# Altium schematic sheet ExpandBoard-103-003.SchDoc
size A4
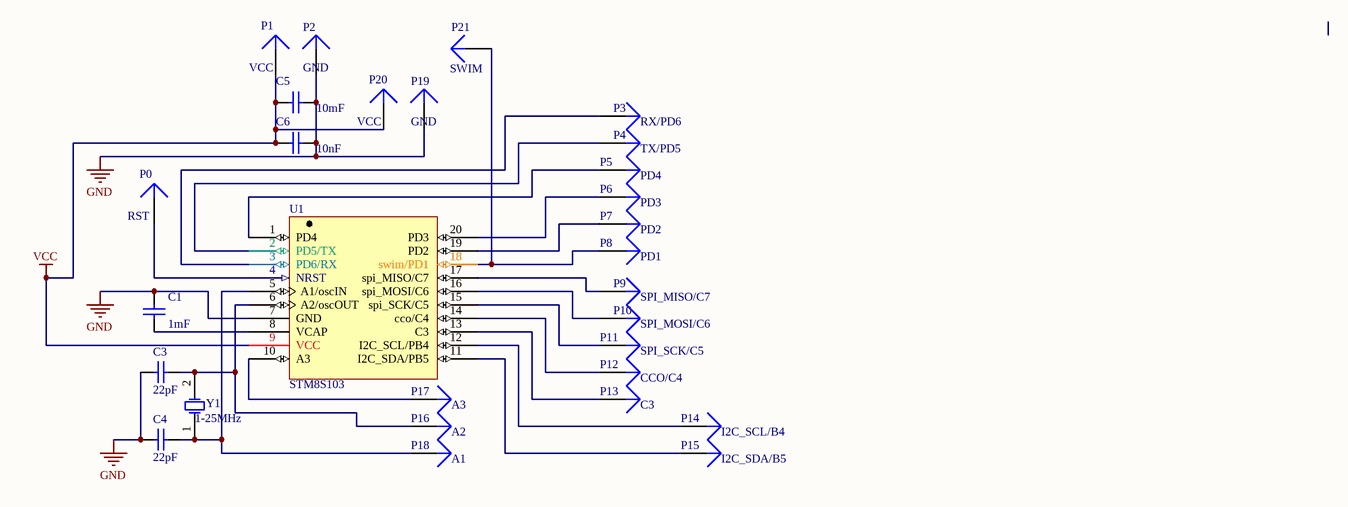
[diagram p0: ExpandBoard-103-003.SchDoc]

## Parts
C1  1mF  [CAPC0805(2012)75_L]
C3  22pF  [CAPC0805(2012)75_N]
C4  22pF  [CAPC0805(2012)75_N]
C5  10mF  [CAPC0805(2012)75_L]
C6  10nF  [CAPC0805(2012)75_L]
P0  RST  [PIN1]
P1  VCC  [PIN1]
P2  GND  [PIN1]
P3  RX/PD6  [PIN1]
P4  TX/PD5  [PIN1]
P5  PD4  [PIN1]
P6  PD3  [PIN1]
P7  PD2  [PIN1]
P8  PD1  [PIN1]
P9  SPI_MISO/C7  [PIN1]
P10  SPI_MOSI/C6  [PIN1]
P11  SPI_SCK/C5  [PIN1]
P12  CCO/C4  [PIN1]
P13  C3  [PIN1]
P14  I2C_SCL/B4  [PIN1]
P15  I2C_SDA/B5  [PIN1]
P16  A2  [PIN1]
P17  A3  [PIN1]
P18  A1  [PIN1]
P19  GND  [PIN1]
P20  VCC  [PIN1]
P21  SWIM  [PIN1]
U1  STM8S103  [TSSOP20]
Y1  1-25MHz  [3.2X1.6X1.1]

## Nets
GND: C1.2 C3.2 C4.2 C5.1 C6.1 P2.1 P19.1 U1.7(GND)
VCC: C5.2 C6.2 P1.1 P20.1 U1.9(VCC)
NetC1_1: C1.1 U1.8(VCAP)
NetC3_1: C3.1 P16.1 U1.6(A2/oscOUT) Y1.2(OSC2)
NetC4_1: C4.1 P18.1 U1.5(A1/oscIN) Y1.1(OSC1)
NetP0_1: P0.1 U1.4(NRST)
NetP3_1: P3.1 U1.3(PD6/RX)
NetP4_1: P4.1 U1.2(PD5/TX)
NetP5_1: P5.1 U1.1(PD4)
NetP6_1: P6.1 U1.20(PD3)
NetP7_1: P7.1 U1.19(PD2)
NetP8_1: P8.1 P21.1 U1.18(swim/PD1)
NetP9_1: P9.1 U1.17(spi_MISO/C7)
NetP10_1: P10.1 U1.16(spi_MOSI/C6)
NetP11_1: P11.1 U1.15(spi_SCK/C5)
NetP12_1: P12.1 U1.14(cco/C4)
NetP13_1: P13.1 U1.13(C3)
NetP14_1: P14.1 U1.12(I2C_SCL/PB4)
NetP15_1: P15.1 U1.11(I2C_SDA/PB5)
NetP17_1: P17.1 U1.10(A3)

## Library data of the parts
C1 C3-C6 = CAP
P0-P21 = Plug: LatestRevisionDate: 17-Jul-2002; LatestRevisionNote: Re-released for DXP Platform.; Publisher: Altium Limited
Y1 = XTAL: Crystal Oscillator; Published: 8-Jun-2000; LatestRevisionDate: 17-Jul-2002; LatestRevisionNote: Re-released for DXP Platform.; PackageReference: R38; Publisher: Altium Limited; PackageDescription: Crystal, Thru-Hole; 2 Leads; Body 3.1 x 8.2 mm (Dia.xH)